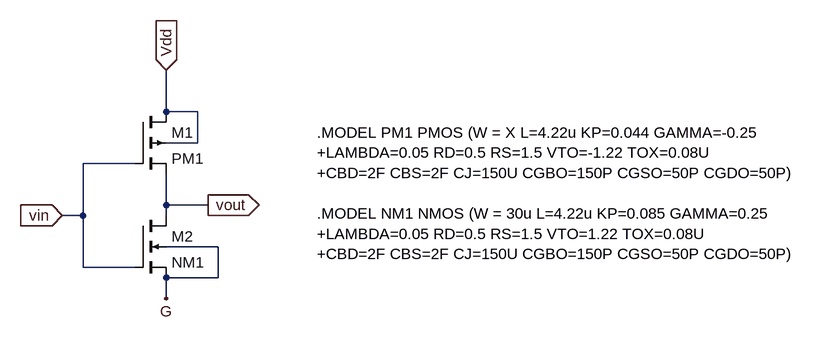
[diagram p0: schematic CMOS INVERTER.asc]
CMOS INVERTER.asc, the LTspice schematic file:
Version 4
SHEET 1 2408 680
WIRE 128 64 128 0
WIRE 176 64 128 64
WIRE 176 112 176 64
WIRE 176 112 128 112
WIRE 80 144 0 144
WIRE 128 208 128 160
WIRE 192 208 128 208
WIRE 0 224 0 144
WIRE 0 224 -32 224
WIRE 128 224 128 208
WIRE 208 272 128 272
WIRE 0 304 0 224
WIRE 80 304 0 304
WIRE 208 320 208 272
WIRE 208 320 128 320
WIRE 128 352 128 320
FLAG -32 224 vin
IOPIN -32 224 In
FLAG 192 208 vout
IOPIN 192 208 Out
FLAG 128 0 Vdd
IOPIN 128 0 In
FLAG 128 352 G
SYMBOL pmos4 80 64 R0
SYMATTR InstName M1
SYMATTR Value PM1
SYMBOL nmos4 80 224 R0
SYMATTR InstName M2
SYMATTR Value NM1
TEXT 360 96 Left 2 !.MODEL PM1 PMOS (W = X L=4.22u KP=0.044 GAMMA=-0.25\n+LAMBDA=0.05 RD=0.5 RS=1.5 VTO=-1.22 TOX=0.08U\n+CBD=2F CBS=2F CJ=150U CGBO=150P CGSO=50P CGDO=50P)\n \n.MODEL NM1 NMOS (W = 30u L=4.22u KP=0.085 GAMMA=0.25\n+LAMBDA=0.05 RD=0.5 RS=1.5 VTO=1.22 TOX=0.08U\n+CBD=2F CBS=2F CJ=150U CGBO=150P CGSO=50P CGDO=50P)

The netlist it stands for:
* CMOS INVERTER.asc
M1 Vdd vin vout Vdd PM1
M2 vout vin G G NM1
.model NMOS NMOS
.model PMOS PMOS
.lib standard.mos
.MODEL PM1 PMOS (W = X L=4.22u KP=0.044 GAMMA=-0.25
+LAMBDA=0.05 RD=0.5 RS=1.5 VTO=-1.22 TOX=0.08U
+CBD=2F CBS=2F CJ=150U CGBO=150P CGSO=50P CGDO=50P)
.MODEL NM1 NMOS (W = 30u L=4.22u KP=0.085 GAMMA=0.25
+LAMBDA=0.05 RD=0.5 RS=1.5 VTO=1.22 TOX=0.08U
+CBD=2F CBS=2F CJ=150U CGBO=150P CGSO=50P CGDO=50P)
.backanno
.end